# Altium project MiniPC.PrjPcb (part 4 of 10)

## Sheet Ethernet1.SchDoc: 10/100/1000  Ethernet XCVR
size B; DocumentNumber: 6; SheetNumber: 6; SheetTotal: 46
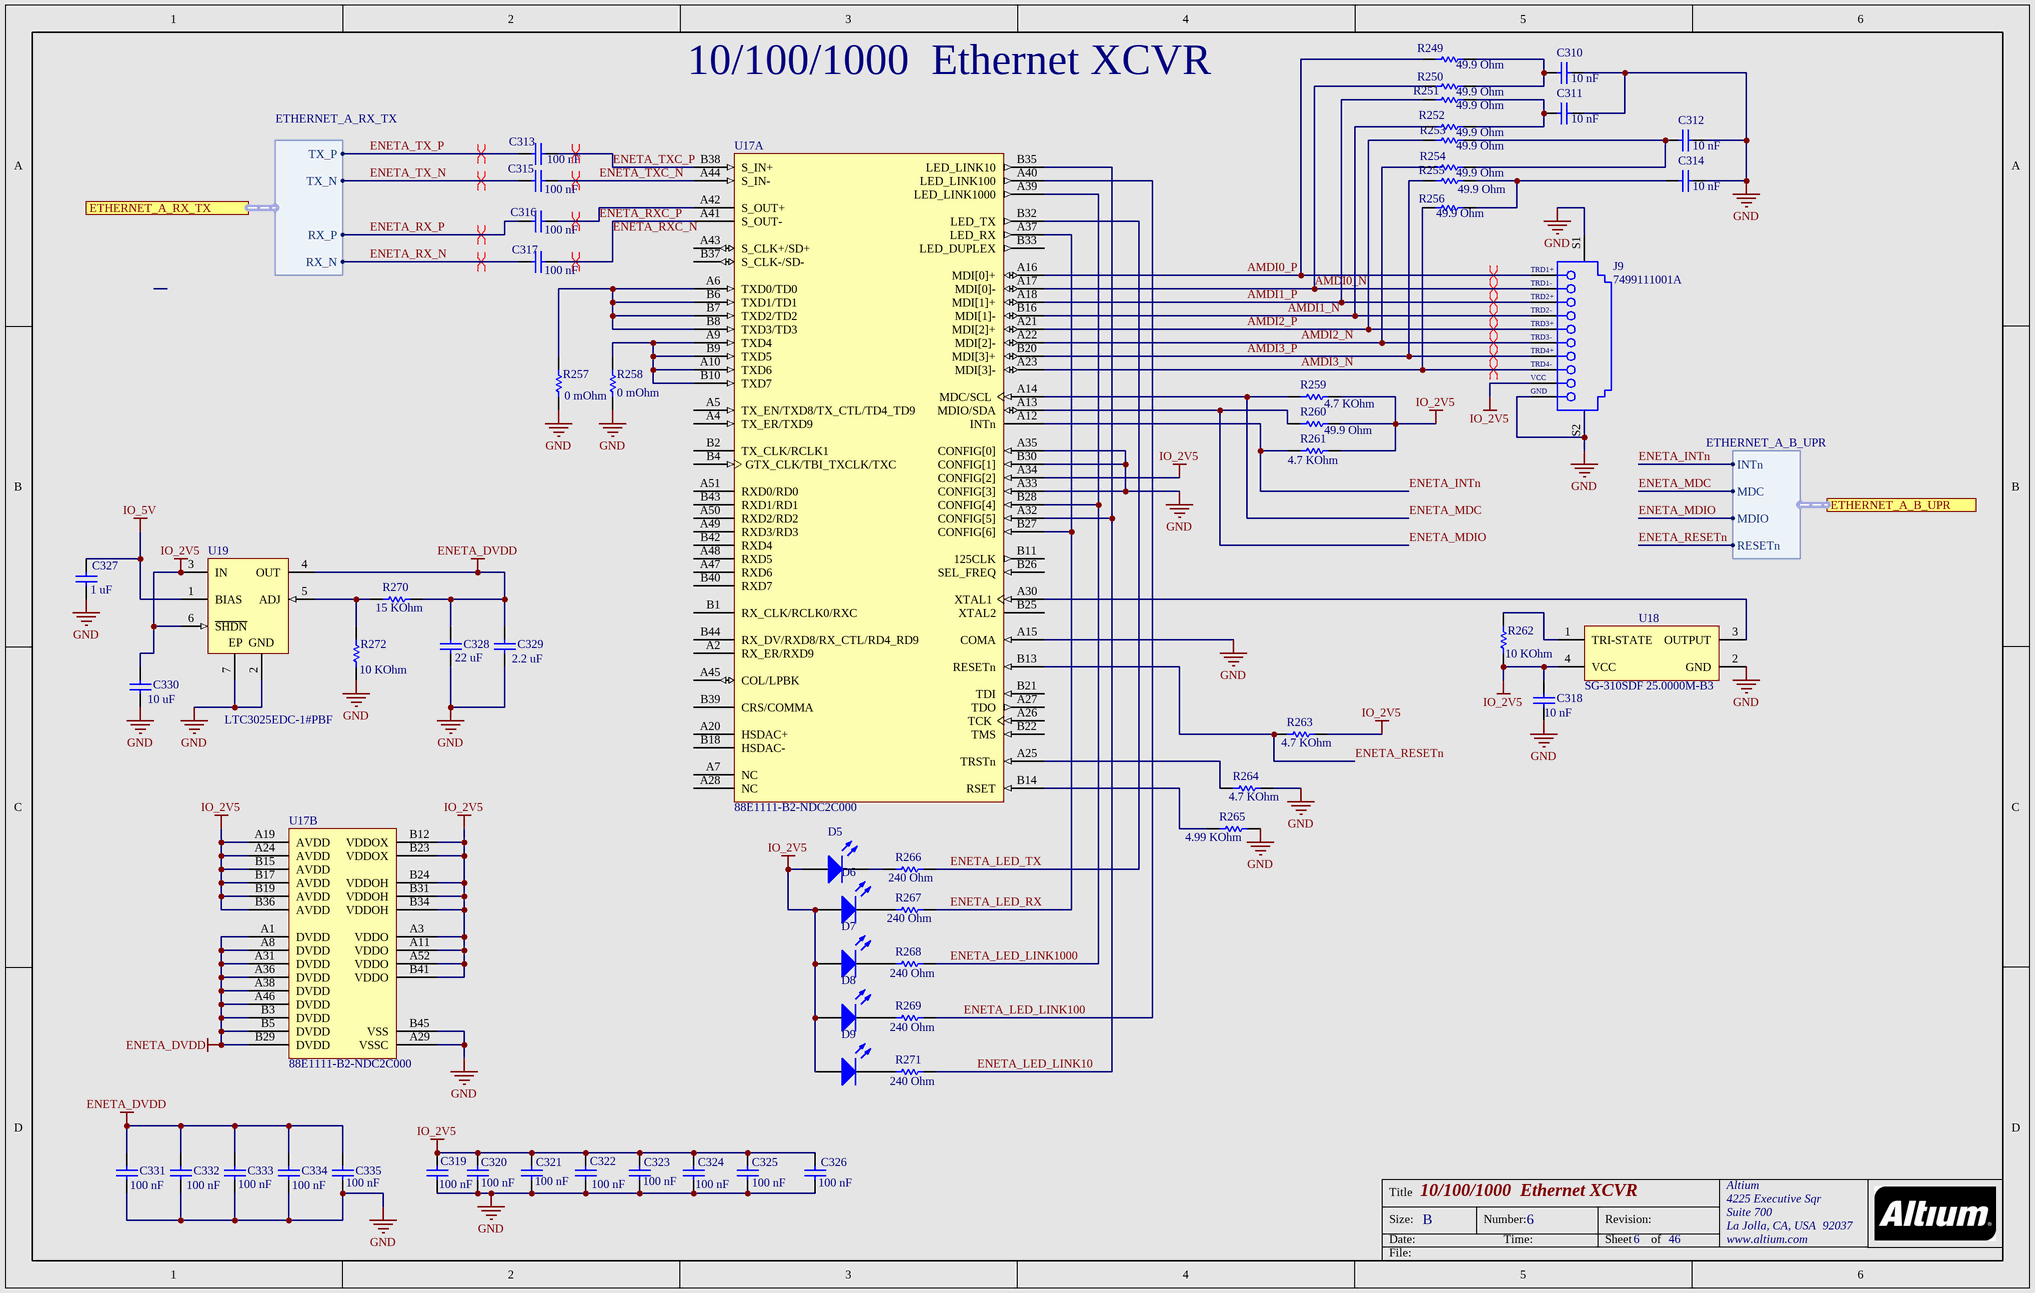
[diagram p14: Ethernet1.SchDoc]

### Parts
C310  Capacitance: 10 nF  [CAPC1005X55X25ML05T10]  (hidden comment: GRM155R71H103KA88D)
C311  Capacitance: 10 nF  [CAPC1005X55X25ML05T10]  (hidden comment: GRM155R71H103KA88D)
C312  Capacitance: 10 nF  [CAPC1005X55X25ML05T10]  (hidden comment: GRM155R71H103KA88D)
C313  Capacitance: 100 nF  [CAPC1005X55X10LL05]  (hidden comment: C1005X7R1E104M)
C314  Capacitance: 10 nF  [CAPC1005X55X25ML05T10]  (hidden comment: GRM155R71H103KA88D)
C315  Capacitance: 100 nF  [CAPC1005X55X10LL05]  (hidden comment: C1005X7R1E104M)
C316  Capacitance: 100 nF  [CAPC1005X55X10LL05]  (hidden comment: C1005X7R1E104M)
C317  Capacitance: 100 nF  [CAPC1005X55X10LL05]  (hidden comment: C1005X7R1E104M)
C318  Capacitance: 10 nF  [CAPC1005X55X25ML05T10]  (hidden comment: GRM155R71H103KA88D)
C319  Capacitance: 100 nF  [CAPC1005X55X10LL05]  (hidden comment: C1005X7R1E104M)
C320  Capacitance: 100 nF  [CAPC1005X55X10LL05]  (hidden comment: C1005X7R1E104M)
C321  Capacitance: 100 nF  [CAPC1005X55X10LL05]  (hidden comment: C1005X7R1E104M)
C322  Capacitance: 100 nF  [CAPC1005X55X10LL05]  (hidden comment: C1005X7R1E104M)
C323  Capacitance: 100 nF  [CAPC1005X55X10LL05]  (hidden comment: C1005X7R1E104M)
C324  Capacitance: 100 nF  [CAPC1005X55X10LL05]  (hidden comment: C1005X7R1E104M)
C325  Capacitance: 100 nF  [CAPC1005X55X10LL05]  (hidden comment: C1005X7R1E104M)
C326  Capacitance: 100 nF  [CAPC1005X55X10LL05]  (hidden comment: C1005X7R1E104M)
C327  Capacitance: 1 uF  [CAPC1005X33X10LL5]  (hidden comment: CGB2A1X5R1E105K033BC)
C328  Capacitance: 22 uF  [CAPC3216X180X55ML20T25]  (hidden comment: GRM31CR61E226KE15L)
C329  Capacitance: 2.2 uF  [CAPC1608X90X35ML10T15]  (hidden comment: GRM188R61A225KE34x)
C330  Capacitance: 10 uF  [CAPC2013X100X20NL20]  (hidden comment: C2012X5R1C106K085AC)
C331  Capacitance: 100 nF  [CAPC1005X55X10LL05]  (hidden comment: C1005X7R1E104M)
C332  Capacitance: 100 nF  [CAPC1005X55X10LL05]  (hidden comment: C1005X7R1E104M)
C333  Capacitance: 100 nF  [CAPC1005X55X10LL05]  (hidden comment: C1005X7R1E104M)
C334  Capacitance: 100 nF  [CAPC1005X55X10LL05]  (hidden comment: C1005X7R1E104M)
C335  Capacitance: 100 nF  [CAPC1005X55X10LL05]  (hidden comment: C1005X7R1E104M)
D5  150060VS75000  [0603_A]  (value not drawn)
D6  150060VS75000  [0603_A]  (value not drawn)
D7  150060VS75000  [0603_A]  (value not drawn)
D8  150060VS75000  [0603_A]  (value not drawn)
D9  150060VS75000  [0603_A]  (value not drawn)
J9  7499111001A  [WE-7499111001A_V]
R249  Resistance: 49.9 Ohm  [RESC1005X35X25NL8T10]  (hidden comment: NRC04F49R9TRF)
R250  Resistance: 49.9 Ohm  [RESC1005X35X25NL8T10]  (hidden comment: NRC04F49R9TRF)
R251  Resistance: 49.9 Ohm  [RESC1005X35X25NL8T10]  (hidden comment: NRC04F49R9TRF)
R252  Resistance: 49.9 Ohm  [RESC1005X35X25NL8T10]  (hidden comment: NRC04F49R9TRF)
R253  Resistance: 49.9 Ohm  [RESC1005X35X25NL8T10]  (hidden comment: NRC04F49R9TRF)
R254  Resistance: 49.9 Ohm  [RESC1005X35X25NL8T10]  (hidden comment: NRC04F49R9TRF)
R255  Resistance: 49.9 Ohm  [RESC1005X35X25NL8T10]  (hidden comment: NRC04F49R9TRF)
R256  Resistance: 49.9 Ohm  [RESC1005X35X25NL8T10]  (hidden comment: NRC04F49R9TRF)
R257  Resistance: 0 mOhm  [RESC1005X40X25ML05T05]  (hidden comment: ERJ-2GE0R00X)
R258  Resistance: 0 mOhm  [RESC1005X40X25ML05T05]  (hidden comment: ERJ-2GE0R00X)
R259  Resistance: 4.7 KOhm  [RESC1005X40X25LL05T05]  (hidden comment: ERJ-2RKF4701X)
R260  Resistance: 49.9 Ohm  [RESC1005X35X25NL8T10]  (hidden comment: NRC04F49R9TRF)
R261  Resistance: 4.7 KOhm  [RESC1005X40X25LL05T05]  (hidden comment: ERJ-2RKF4701X)
R262  Resistance: 10 KOhm  [RESC1005X40X25NL05T05]  (hidden comment: ERJ-2RKF1002X)
R263  Resistance: 4.7 KOhm  [RESC1005X40X25LL05T05]  (hidden comment: ERJ-2RKF4701X)
R264  Resistance: 4.7 KOhm  [RESC1005X40X25LL05T05]  (hidden comment: ERJ-2RKF4701X)
R265  Resistance: 4.99 KOhm  [RESC1005X40X25NL05T05]  (hidden comment: ERJ-2RKF4991X)
R266  Resistance: 240 Ohm  [RESC1005X40X25NL05T05]  (hidden comment: ERJ-2RKF2400X)
R267  Resistance: 240 Ohm  [RESC1005X40X25NL05T05]  (hidden comment: ERJ-2RKF2400X)
R268  Resistance: 240 Ohm  [RESC1005X40X25NL05T05]  (hidden comment: ERJ-2RKF2400X)
R269  Resistance: 240 Ohm  [RESC1005X40X25NL05T05]  (hidden comment: ERJ-2RKF2400X)
R270  Resistance: 15 KOhm  [RESC1005X40X25ML05T05]  (hidden comment: ERJ-2RKF1502X)
R271  Resistance: 240 Ohm  [RESC1005X40X25NL05T05]  (hidden comment: ERJ-2RKF2400X)
R272  Resistance: 10 KOhm  [RESC1005X40X25NL05T05]  (hidden comment: ERJ-2RKF1002X)
U17  88E1111-B2-NDC2C000  [MARV-NDC96]  (parts A,B of 2)
U18  SG-310SDF 25.0000M-B3  [EPSON-SG-310-4_V]
U19  LTC3025EDC-1#PBF  [LT-DC6-6_V]

### Ports
ETHERNET_A_B_UPR (harness ETHERNET_A_B_UPR), ETHERNET_A_RX_TX (harness ETHERNET_A_RX_TX)

### Harnesses
ETHERNET_A_B_UPR: INTn, MDC, MDIO, RESETn
ETHERNET_A_RX_TX: RX_P, RX_N, TX_P, TX_N

### Nets
ENETA_DVDD: C328.2 C329.2 C331.2 C332.2 C333.2 C334.2 C335.2 R270.2 U17.A1(DVDD) U17.A8(DVDD) U17.A31(DVDD) U17.A36(DVDD) U17.A38(DVDD) U17.A46(DVDD) U17.B3(DVDD) U17.B5(DVDD) U17.B29(DVDD) U19.4(OUT)
GND: C310.2 C311.2 C312.2 C314.2 C318.1 C319.1 C320.1 C321.1 C322.1 C323.1 C324.1 C325.1 C326.1 C327.1 C328.1 C329.1 C330.1 C331.1 C332.1 C333.1 C334.1 C335.1 J9.10(GND) J9.S1(SHLD) J9.S2(SHLD) R257.1 R258.1 R264.2 R265.2 R272.1 U17.A15(COMA) U17.A29(VSSC) U17.A33(CONFIG[3]) U17.A35(CONFIG[0]) U17.B30(CONFIG[1]) U17.B45(VSS) U18.2(GND) U19.2(GND) U19.7(EP)
IO_2V5: C318.2 C319.2 C320.2 C321.2 C322.2 C323.2 C324.2 C325.2 C326.2 C330.2 D5.2(A) D6.2(A) D7.2(A) D8.2(A) D9.2(A) J9.9(VCC) R259.2 R260.2 R261.2 R262.1 R263.2 U17.A3(VDDO) U17.A11(VDDO) U17.A19(AVDD) U17.A24(AVDD) U17.A34(CONFIG[2]) U17.A52(VDDO) U17.B12(VDDOX) U17.B15(AVDD) U17.B17(AVDD) U17.B19(AVDD) U17.B23(VDDOX) U17.B24(VDDOH) U17.B31(VDDOH) U17.B34(VDDOH) U17.B36(AVDD) U17.B41(VDDO) U18.4(VCC) U19.3(IN) U19.6(~{SHDN})
IO_5V: C327.2 U19.1(BIAS)
AMDI0_N: J9.2(TRD1-) R250.1 U17.A17(MDI[0]-)
AMDI0_P: J9.1(TRD1+) R249.1 U17.A16(MDI[0]+)
AMDI1_N: J9.4(TRD2-) R252.1 U17.B16(MDI[1]-)
AMDI1_P: J9.3(TRD2+) R251.1 U17.A18(MDI[1]+)
AMDI2_N: J9.6(TRD3-) R254.1 U17.A22(MDI[2]-)
AMDI2_P: J9.5(TRD3+) R253.1 U17.A21(MDI[2]+)
AMDI3_N: J9.8(TRD4-) R256.1 U17.A23(MDI[3]-)
AMDI3_P: J9.7(TRD4+) R255.1 U17.B20(MDI[3]+)
ENETA_INTn: R261.1 U17.A12(INTn) ; port ETHERNET_A_B_UPR.INTn
ENETA_LED_LINK10: R271.2 U17.A32(CONFIG[5]) U17.B35(LED_LINK10)
ENETA_LED_LINK100: R269.2 U17.A40(LED_LINK100)
ENETA_LED_LINK1000: R268.2 U17.A39(LED_LINK1000) U17.B28(CONFIG[4])
ENETA_LED_RX: R267.2 U17.A37(LED_RX) U17.B27(CONFIG[6])
ENETA_LED_TX: R266.2 U17.B32(LED_TX)
ENETA_MDC: R259.1 U17.A14(MDC/SCL) ; port ETHERNET_A_B_UPR.MDC
ENETA_MDIO: R260.1 U17.A13(MDIO/SDA) ; port ETHERNET_A_B_UPR.MDIO
ENETA_RESETn: R263.1 U17.B13(RESETn) ; port ETHERNET_A_B_UPR.RESETn
ENETA_RX_N: C317.1 ; port ETHERNET_A_RX_TX.RX_N
ENETA_RX_P: C316.1 ; port ETHERNET_A_RX_TX.RX_P
ENETA_RXC_N: C317.2 U17.A41(S_OUT-)
ENETA_RXC_P: C316.2 U17.A42(S_OUT+)
ENETA_TX_N: C315.1 ; port ETHERNET_A_RX_TX.TX_N
ENETA_TX_P: C313.1 ; port ETHERNET_A_RX_TX.TX_P
ENETA_TXC_N: C315.2 U17.A44(S_IN-)
ENETA_TXC_P: C313.2 U17.B38(S_IN+)
NetC310_1: C310.1 R249.2 R250.2
NetC311_1: C311.1 R251.2 R252.2
NetC312_1: C312.1 R253.2 R254.2
NetC314_1: C314.1 R255.2 R256.2
NetD5_1: D5.1(K) R266.1
NetD6_1: D6.1(K) R267.1
NetD7_1: D7.1(K) R268.1
NetD8_1: D8.1(K) R269.1
NetD9_1: D9.1(K) R271.1
NetR257_2: R257.2 U17.A6(TXD0/TD0) U17.B6(TXD1/TD1) U17.B7(TXD2/TD2) U17.B8(TXD3/TD3)
NetR258_2: R258.2 U17.A9(TXD4) U17.A10(TXD6) U17.B9(TXD5) U17.B10(TXD7)
NetR262_2: R262.2 U18.1(TRI-STATE)
NetR264_1: R264.1 U17.A25(TRSTn)
NetR265_1: R265.1 U17.B14(RSET)
NetR270_1: R270.1 R272.2 U19.5(ADJ)
NetU17_A30: U17.A30(XTAL1) U18.3(OUTPUT)

Not connected (* = marked no-connect by the designer): U17 A2(RX_ER/RXD9) A4(TX_ER/TXD9) A5(TX_EN/TXD8/TX_CTL/TD4_TD9) A7(NC) A20(HSDAC+) A26(TCK) A27(TDO) A28(NC) A43(S_CLK+/SD+) A45(COL/LPBK) A47(RXD6) A48(RXD5) A49(RXD3/RD3) A50(RXD2/RD2) A51(RXD0/RD0) B1(RX_CLK/RCLK0/RXC) B2(TX_CLK/RCLK1) B4(GTX_CLK/TBI_TXCLK/TXC) B11(125CLK) B18(HSDAC-) B21(TDI) B22(TMS) B25(XTAL2) B26(SEL_FREQ) B33(LED_DUPLEX) B37(S_CLK-/SD-) B39(CRS/COMMA) B40(RXD7) B42(RXD4) B43(RXD1/RD1) B44(RX_DV/RXD8/RX_CTL/RD4_RD9)

### Layout directives
differential pair: AMDI0_N, AMDI0_P, AMDI1_N, AMDI1_P, AMDI2_N, AMDI2_P, AMDI3_N, AMDI3_P, ENETA_RX_N, ENETA_RX_P, ENETA_RXC_N, ENETA_RXC_P, ENETA_TX_N, ENETA_TX_P, ENETA_TXC_N, ENETA_TXC_P

### Notes on the sheet
- Title
- Size:
- Date:
- B
- Number:
- Time:
- Revision:
- Sheet
- of
- File:

### Library data of the parts
C310-C312 C314 C318 = CMP-2008-04637-4: as C362 on sheet Ethernet-HPS; Mounting Technology: Surface Mount; Max Operating Temperature: 125 degC; Height: 0.5 mm; PackageDescription: 2-Pin Surface Mount Device, Body 1 x 0.5 mm; Case Code (Imperial): 0402; Tolerance: 10%; ComponentLink1URL: http://www.murata.com/; RoHSCompliant: true; Width: 0.5 mm; Package Quantity: 10000; Packaging: Tape and Reel; ComponentLink1Description: Manufacturer URL; Min Operating Temperature: -55 degC; PartNumber: GRM155R71H103KA88D; REACH SVHC: No SVHC; Case Code (Metric): 1005; Length: 1 mm; DatasheetVersion: 02/2016; Mount: Surface Mount; Radiation Hardening: No; Lead Pitch: 2mm; Voltage Rating (DC): 50 V; Pins: 2; ComponentLink2URL: http://search.murata.co.jp/Ceramy/image/img/A01X/G101/ENG/GRM155R71H103KA88-01.pdf; ComponentLink2Description: Datasheet; PackageReference: 0402
C313 C315-C317 C319-C326 C331-C335 = CMP-1663-00009-2: as C369 on sheet Ethernet-HPS; Tolerance: 20%; Max Operating Temperature: 125 degC; ComponentLink2URL: http://www.farnell.com/datasheets/1571323.pdf; ComponentLink1URL: http://www.tdk.com/; RoHSCompliant: true; Packaging: Tape and Reel; Mounting Technology: Surface Mount; ComponentLink2Description: Datasheet; Case Code (Imperial): 0402; DatasheetVersion: 09/2011; ComponentLink1Description: Manufacturer URL; PackageDescription: 2-Pin Surface Mount Device, Body 1 x 0.5 mm; PackageReference: 0402; Min Operating Temperature: -55 degC; Case Code (Metric): 1005; Height: 0.5 mm; Package Quantity: 10000; Width: 0.5 mm; Pins: 2; Voltage Rating (DC): 25 V; PartNumber: C1005X7R1E104M; Mount: Surface Mount; Length: 1 mm
C327 = CMP-1663-00006-2: as C384 on sheet Ethernet-HPS; DatasheetVersion: 04/2015; Mounting Technology: Surface Mount; ComponentLink2Description: Datasheet; PackageDescription: 2-Pin Surface Mount Device, Body 1 x 0.5 mm; ComponentLink1URL: http://www.tdk.com/; ComponentLink1Description: Manufacturer URL; ComponentLink2URL: https://product.tdk.com/info/en/catalog/datasheets/mlcc_commercial_lowprofile_en.pdf; PartNumber: CGB2A1X5R1E105K033BC; Case Code (Metric): 1005; RoHSCompliant: True; Max Operating Temperature: 85 degC; Package Quantity: 1; Width: 0.02 inch; Case/Package: 0402; Case Code (Imperial): 0402; Packaging: Tape and Reel; Tolerance: 10%; Length: 0.039 inch; Min Operating Temperature: -55 degC
C328 = CMP-1662-00010-2: as C367 on sheet Ethernet-HPS; Tolerance: 10%; Max Operating Temperature: 85 degC; Package Quantity: 2000; Voltage Rating: 25 V; Case Code (Metric): 3216; Length: 3.2 mm; PackageDescription: 2-Pin Surface Mount Device, Body 3.2 x 1.6 mm; ComponentLink1Description: Manufacturer URL; Case Code (Imperial): 1206; ComponentLink1URL: http://www.murata.com/; Radiation Hardening: No; Height: 1.6 mm; Width: 1.6 mm; DatasheetVersion: 03/2016; Min Operating Temperature: -55 degC; Mount: Surface Mount; REACH SVHC: No SVHC; PackageReference: 1206; ComponentLink2URL: http://search.murata.co.jp/Ceramy/image/img/A01X/G101/ENG/GRM31CR61E226KE15-01.pdf; Packaging: Tape and Reel; RoHSCompliant: true; ComponentLink2Description: Datasheet; Mounting Technology: Surface Mount; PartNumber: GRM31CR61E226KE15L; Pins: 2
C329 = CMP-1662-00016-2: as C368 on sheet Ethernet-HPS; Tolerance: 10%; Width: 0.031 inch; DatasheetVersion: 01/2013; Case/Package: 0603; Length: 0.063 inch; PartNumber: GRM188R61A225KE34x; Package Quantity: 10000; Case Code (Imperial): 0603; Packaging: Tape and Reel; PackageDescription: 2-Pin Surface Mount Device, Body 1.6 x 0.8 mm; Case Code (Metric): 1608; ComponentLink1Description: Manufacturer URL; Radiation Hardening: No; Mounting Technology: Surface Mount; Height: 0.8 mm; RoHSCompliant: True; ComponentLink2URL: https://datasheet.ciiva.com/134/grm188r61a225ke34-01-134206.pdf; ComponentLink2Description: Datasheet; Max Operating Temperature: 85 degC; Min Operating Temperature: -55 degC; ComponentLink1URL: http://www.murata.com/
C330 = CMP-1663-00007-1: as C370 on sheet Ethernet-HPS; Tolerance: 10%; Mounting Technology: Surface Mount; Min Operating Temperature: -55 degC; Length: 2 mm; Case Code (Metric): 2012; PackageReference: 0805; Voltage Rating: 16 V; RoHSCompliant: true; ComponentLink1Description: Manufacturer URL; Width: 1.25 mm; ComponentLink1URL: http://www.tdk.com/; Max Operating Temperature: 85 degC; REACH SVHC: No SVHC; Mount: Surface Mount; ComponentLink2URL: https://product.tdk.com/info/en/catalog/datasheets/mlcc_commercial_general_en.pdf; ComponentLink2Description: Datasheet; Pins: 2; Packaging: Tape and Reel; Height: 0.85 mm; Package Quantity: 1; DatasheetVersion: 03/2015; Case Code (Imperial): 0805; PackageDescription: 2-Pin Surface Mount Device, Body 2 x 1.25 mm
D5-D9 = CMP-1426-00006-1: SMD mono-color Chip LED, WL-SMCW, Bright Green; Manufacturer: Wuerth Elektronik; ComponentLink2URL: http://katalog.we-online.com/led/datasheet/150060VS75000.pdf; ComponentLink1Description: Manufacturer URL; PackageReference: 0603_A; PartNumber: 150060VS75000; ComponentLink2Description: Datasheet; ComponentLink1URL: http://www.we-online.com; Color: Bright Green
J9 = CMP-1710-00001-3: RJ45 LAN Transformer, Modular JACK, 0 to 70 degC, 10-Pin THD, RoHS, Tube; ComponentLink1URL: https://www.we-online.com/; ComponentLink2URL: https://katalog.we-online.de/pbs/datasheet/7499111001A.pdf; ComponentLink2Description: Datasheet; Mounting Technology: Through Hole; PackageDescription: 10-Pin Through Hole Device, Body 21.84 x 16 mm; ComponentLink1Description: Manufacturer URL; PartNumber: 7499111001A; DatasheetVersion: Rev. 01; RoHSCompliant: False
R249-R256 R260 = CMP-1599-00001-2: as R300 on sheet Ethernet-HPS; Tolerance: 1%; ComponentLink2Description: Datasheet; RoHSCompliant: True; DatasheetVersion: 11/2008; Max Operating Temperature: 155 degC; PartNumber: NRC04F49R9TRF; Radiation Hardening: No; PackageDescription: 2-Pin Surface Mount Device, Body 1 x 0.5 mm; Case/Package: 0402; Height: 0.3 mm; Length: 1 mm; ComponentLink1Description: Manufacturer URL; ComponentLink1URL: http://www.niccomp.com/; Mounting Technology: Surface Mount; Packaging: Tape and Reel; ComponentLink2URL: https://datasheet.ciiva.com/27056/2008575-27056094.pdf; Min Operating Temperature: -55 degC
R257 R258 = CMP-2002-00429-3: as R245 on sheet Display_Port; Max Operating Temperature: 155 degC; Tolerance: 5%; PartNumber: ERJ-2GE0R00X; Case Code (Imperial): 0402; Package Quantity: 10000; Length: 1 mm; Mounting Technology: Surface Mount; ComponentLink1URL: http://www.panasonic.com/; Height: 0.35 mm; Width: 0.5 mm; Min Operating Temperature: -55 degC; Case Code (Metric): 1005; RoHSCompliant: true; REACH SVHC: Unknown; ComponentLink1Description: Manufacturer URL; Packaging: Tape and Reel; Mount: Surface Mount; PackageDescription: 2-Pin Surface Mount Device, Body 1 x 0.5 mm; PackageReference: 0402; ComponentLink2URL: http://industrial.panasonic.com/cdbs/www-data/pdf/RDA0000/AOA0000C84.pdf; DatasheetVersion: 03/2015; Radiation Hardening: No; Pins: 2; ComponentLink2Description: Datasheet
R259 R261 R263 R264 = CMP-1665-00031-3: as R302 on sheet Ethernet-HPS; Tolerance: 1%; Case Code (Imperial): 0402; PartNumber: ERJ-2RKF4701X; Mounting Technology: Surface Mount; ComponentLink1Description: Manufacturer URL; Width: 0.5 mm; DatasheetVersion: 04/2015; PackageDescription: 2-Pin Surface Mount Device, Body 1 x 0.5 mm; ComponentLink2Description: Datasheet; Packaging: Cut Tape; RoHSCompliant: true; Package Quantity: 1; Height: 0.35 mm; REACH SVHC: Yes; Case Code (Metric): 1005; Max Operating Temperature: 155 degC; ComponentLink1URL: http://www.panasonic.com/; Radiation Hardening: No; ComponentLink2URL: http://industrial.panasonic.com/cdbs/www-data/pdf/RDA0000/AOA0000C86.pdf; Min Operating Temperature: -55 degC; Length: 1 mm; Pins: 2; PackageReference: 0402; Mount: Surface Mount
R262 R272 = CMP-2002-00607-3: as R311 on sheet Ethernet-HPS; Case Code (Imperial): 0402; Min Operating Temperature: -55 degC; PartNumber: ERJ-2RKF1002X; Mounting Technology: Surface Mount; Length: 1 mm; Packaging: Tape and Reel; ComponentLink1Description: Manufacturer URL; Mount: Surface Mount; Package Quantity: 10000; Max Operating Temperature: 155 degC; Case Code (Metric): 1005; Height: 0.35 mm; ComponentLink1URL: http://www.panasonic.com/; Tolerance: 1%; REACH SVHC: Yes; RoHSCompliant: true; Width: 0.5 mm; PackageDescription: 2-Pin Surface Mount Device, Body 1 x 0.5 mm; Radiation Hardening: No; PackageReference: 0402; ComponentLink2Description: Datasheet; DatasheetVersion: 04/2015; ComponentLink2URL: http://industrial.panasonic.com/cdbs/www-data/pdf/RDA0000/AOA0000C86.pdf; Pins: 2
R265 = CMP-2002-00966-3: Chip Resistor, 4.99 KOhm, +/- 1%, 100 mW, -55 to 155 degC, 0402 (1005 Metric), RoHS, Tape and Reel; Manufacturer: Basic Passives; Voltage Rating: 50 V; Power Rating: 100 mW; Case\/Package: 0402; Length: 1 mm; Package Quantity: 10000; Width: 0.5 mm; PartNumber: ERJ-2RKF4991X; Tolerance: 1%; REACH SVHC: Unknown; Case Code (Imperial): 0402; Height: 0.35 mm; Mount: Surface Mount; RoHSCompliant: true; PackageDescription: 2-Pin Surface Mount Device, Body 1 x 0.5 mm; Max Operating Temperature: 155 degC; ComponentLink1URL: http://www.panasonic.com/; Min Operating Temperature: -55 degC; Packaging: Tape and Reel; ComponentLink1Description: Manufacturer URL; Mounting Technology: Surface Mount; Case Code (Metric): 1005; ComponentLink2URL: http://industrial.panasonic.com/cdbs/www-data/pdf/RDA0000/AOA0000C86.pdf; PackageReference: 0402; Radiation Hardening: No; Pins: 2; DatasheetVersion: 04/2015; ComponentLink2Description: Datasheet; Weight: 2.8E-05oz
R266-R269 R271 = CMP-1665-00034-1: Chip Resistor, 240 Ohm, +/- 1%, 100 mW, -55 to 155 degC, 0402 (1005 Metric), RoHS, Tape and Reel; Power Rating: 100 mW; Voltage Rating: 50 V; Case\/Package: 0402; Tolerance: 1%; Packaging: Tape and Reel; Case Code (Imperial): 0402; Mount: Surface Mount; Min Operating Temperature: -55 degC; RoHSCompliant: true; Mounting Technology: Surface Mount; Max Operating Temperature: 155 degC; REACH SVHC: Unknown; Package Quantity: 10000; ComponentLink1URL: http://www.panasonic.com/; PartNumber: ERJ-2RKF2400X; ComponentLink1Description: Manufacturer URL; Height: 0.35 mm; PackageDescription: 2-Pin Surface Mount Device, Body 1 x 0.5 mm; Width: 0.5 mm; Length: 1 mm; Case Code (Metric): 1005; Radiation Hardening: No; ComponentLink2Description: Datasheet; ComponentLink2URL: http://industrial.panasonic.com/cdbs/www-data/pdf/RDA0000/AOA0000C86.pdf; PackageReference: 0402; DatasheetVersion: 04/2015; Pins: 2
R270 = CMP-2002-00694-3: Chip Resistor, 15 KOhm, +/- 1%, 100 mW, -55 to 155 degC, 0402 (1005 Metric), RoHS, Tape and Reel; Manufacturer: Basic Passives; Power Rating: 100 mW; Voltage Rating: 50 V; Case\/Package: 0402; Max Operating Temperature: 155 degC; Case Code (Imperial): 0402; Case Code (Metric): 1005; PartNumber: ERJ-2RKF1502X; Package Quantity: 10000; REACH SVHC: Yes; Width: 0.5 mm; Mount: Surface Mount; Mounting Technology: Surface Mount; Packaging: Tape and Reel; Tolerance: 1%; ComponentLink1Description: Manufacturer URL; ComponentLink1URL: http://www.panasonic.com/; Height: 0.35 mm; Length: 1 mm; PackageDescription: 2-Pin Surface Mount Device, Body 1 x 0.5 mm; Min Operating Temperature: -55 degC; RoHSCompliant: true; Pins: 2; PackageReference: 0402; DatasheetVersion: 04/2015; ComponentLink2URL: http://industrial.panasonic.com/cdbs/www-data/pdf/RDA0000/AOA0000C86.pdf; Weight: 2.8E-05oz; Radiation Hardening: No; ComponentLink2Description: Datasheet
U17 = CMP-1702-00002-3: Integrated 10/100/1000 Ultra Gigabit Ethernet Transceiver, Commercial Grade, 96-Pin QFN, RoHS; ComponentLink1URL: http://www.marvell.com/; Mounting Technology: Surface Mount; PackageDescription: 96-Pin Quad Flat No-lead Package, Body 9 x 9 mm, Pitch 0.3 mm; ComponentLink2URL: http://www.marvell.com//transceivers/assets/Marvell-Alaska-Ultra-88E1111-GbE.pdf; PartNumber: 88E1111-B2-NDC2C000; ComponentLink2Description: Datasheet; DatasheetVersion: Rev. A; ComponentLink1Description: Manufacturer URL
U18 = CMP-1695-00002-3: as U24 on sheet Ethernet-HPS; ComponentLink2URL: http://www5.epsondevice.com/en/products/spxo_standard/sg310sdf.html#; DatasheetVersion: Rev. Feb-15; ComponentLink1Description: Manufacturer URL; ComponentLink1URL: https://www.eea.epson.com/; Mounting Technology: Surface Mount; PartNumber: SG-310SDF 25.0000M-B3; PackageDescription: 4-Pin Surface Mount Device, Body 3.2 x 2.5 mm; ComponentLink2Description: Datasheet; Max Operating Temperature: 70 degC; Length: 3.2 mm; Packaging: Tape and Reel; Height: 1.05 mm; RoHSCompliant: True; Min Operating Temperature: -20 degC; Width: 2.5 mm
U19 = CMP-0476-00124-4: 500 mA Micropower VLDO Linear Regulator, 0.9 to 5.5 V Vin, Adjustable Vout, 6-pin SON (DC6-6), -40 to 125 degC, Pb-Free; Manufacturer: Linear Technology; Vin Max(V): 5.5; Noise(uV): 80; Vout Min(V): 0.4; Isupply(mA): 0.05; Number of Outputs: 1; Output Voltage: Adj; Dropout Voltage(V): 0.085; Vout Max(V): 3.6; Discrete Pass Element: no; Iout(mA): 500; Vin Min(V): 0.9; ComponentLink1URL: http://www.linear.com/; ComponentLink2URL: http://cds.linear.com/docs/en/datasheet/30251234ff.pdf; ComponentLink1Description: Manufacturer URL; Mounting Technology: Surface Mount; DatasheetVersion: Rev. F; PartNumber: LTC3025EDC-1#PBF; ComponentLink2Description: Datasheet; ComponentLink3URL: http://cds.linear.com/docs/en/packaging/DFN_6_05-08-1703.pdf; PackageDescription: 6-Pin Plastic DFN, Body 2 x 2 mm, Pitch 0.5 mm; Shutdown Current(uA): 1; PackageVersion: Rev. B, 06/2010; ComponentLink3Description: Package Specification; RoHS: TRUE; PackageReference: DC6-6; Code_JEDEC: MO-229

## Sheet Ethernet2.SchDoc: 10/100/1000  Ethernet XCVR
size B; Address1: тро; DocumentNumber: 7; SheetNumber: 7; SheetTotal: 46
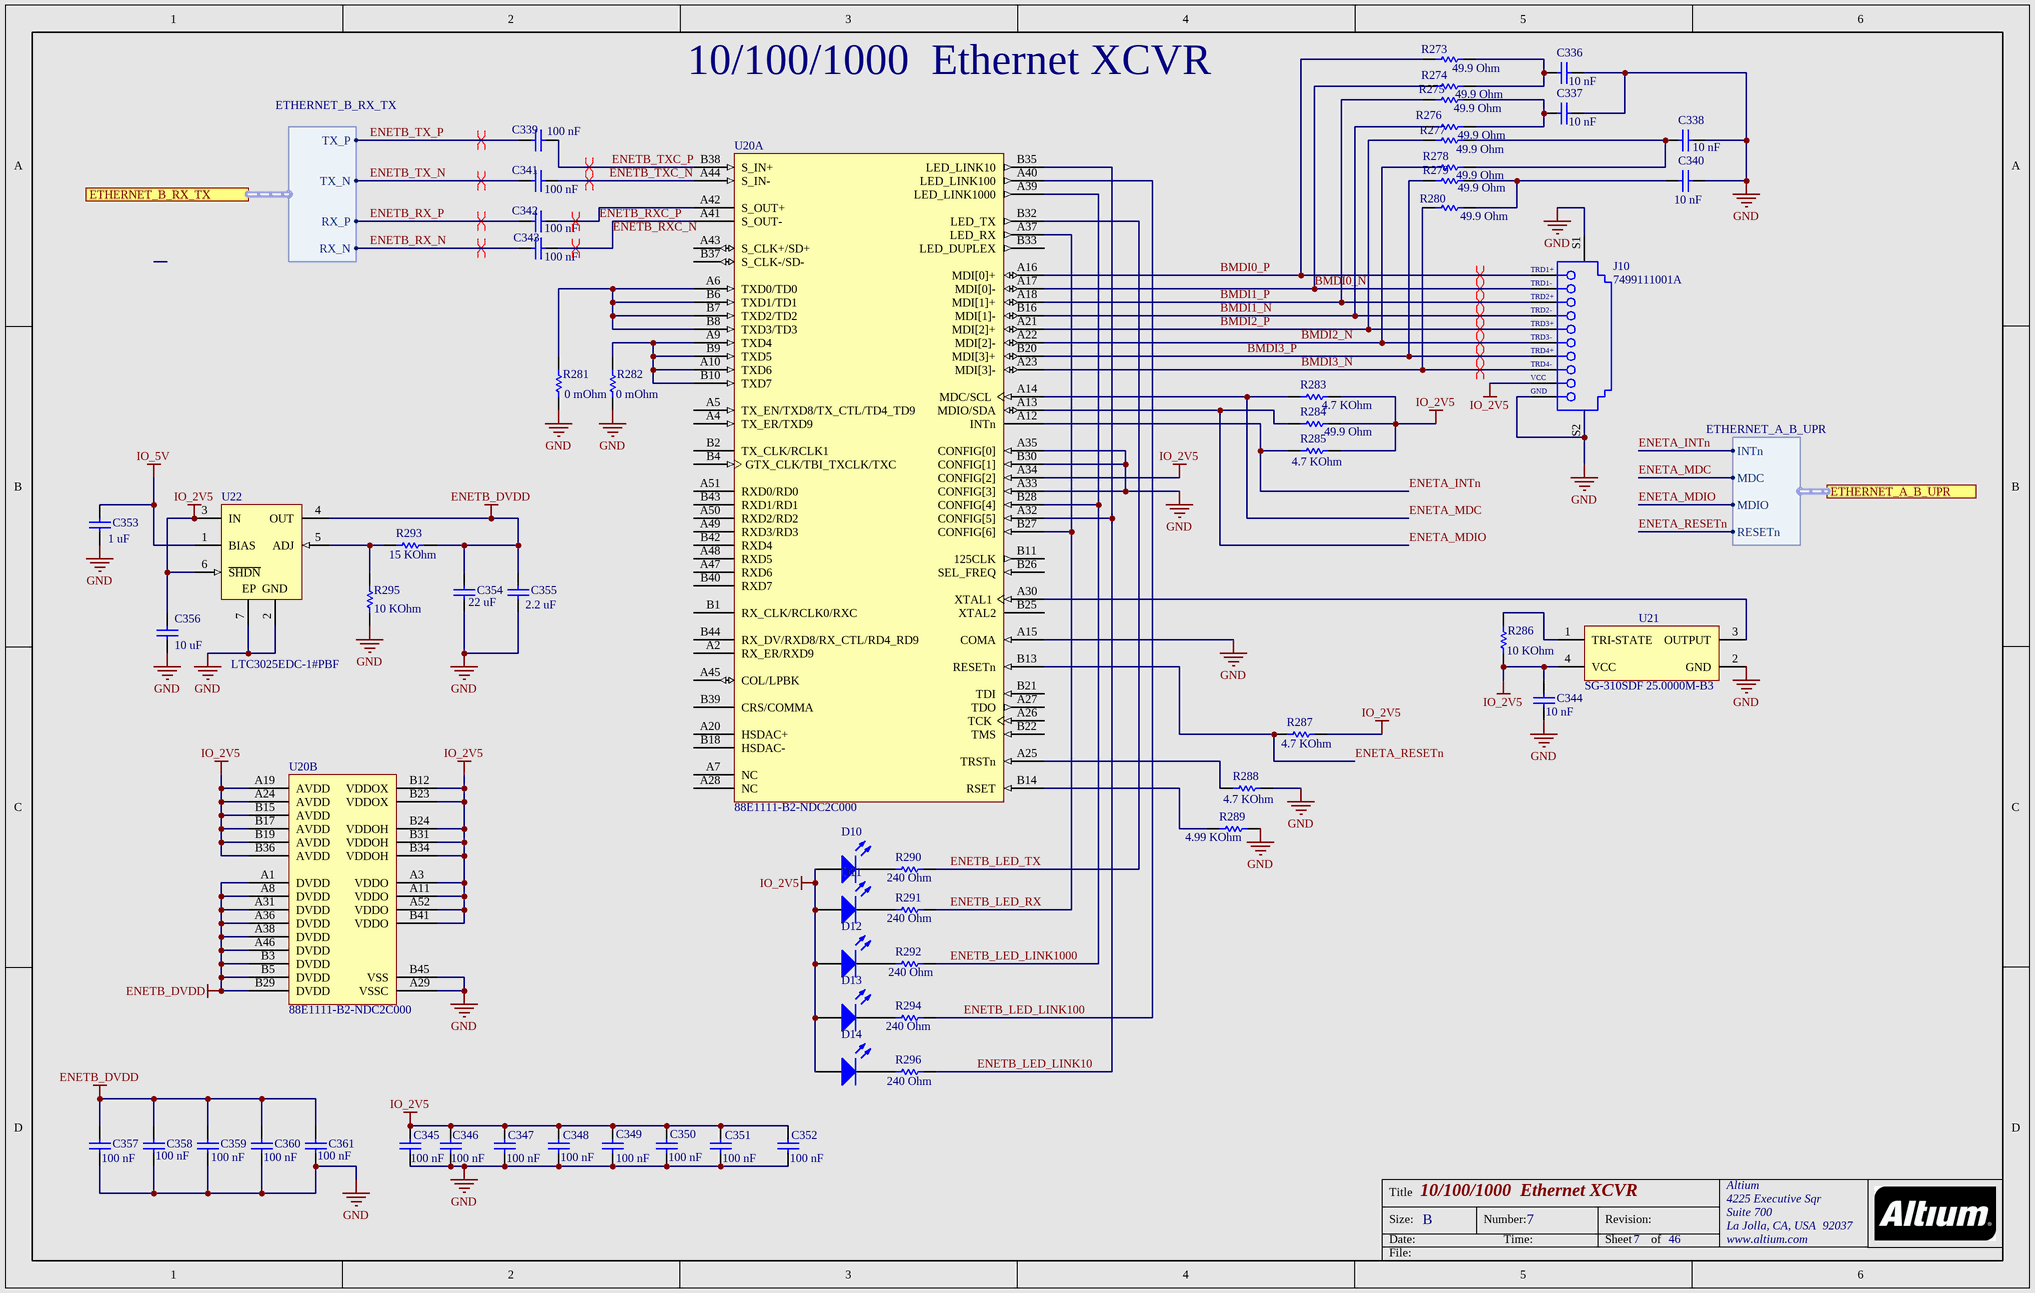
[diagram p15: Ethernet2.SchDoc]

### Parts
C336  Capacitance: 10 nF  [CAPC1005X55X25ML05T10]  (hidden comment: GRM155R71H103KA88D)
C337  Capacitance: 10 nF  [CAPC1005X55X25ML05T10]  (hidden comment: GRM155R71H103KA88D)
C338  Capacitance: 10 nF  [CAPC1005X55X25ML05T10]  (hidden comment: GRM155R71H103KA88D)
C339  Capacitance: 100 nF  [CAPC1005X55X10LL05]  (hidden comment: C1005X7R1E104M)
C340  Capacitance: 10 nF  [CAPC1005X55X25ML05T10]  (hidden comment: GRM155R71H103KA88D)
C341  Capacitance: 100 nF  [CAPC1005X55X10LL05]  (hidden comment: C1005X7R1E104M)
C342  Capacitance: 100 nF  [CAPC1005X55X10LL05]  (hidden comment: C1005X7R1E104M)
C343  Capacitance: 100 nF  [CAPC1005X55X10LL05]  (hidden comment: C1005X7R1E104M)
C344  Capacitance: 10 nF  [CAPC1005X55X25ML05T10]  (hidden comment: GRM155R71H103KA88D)
C345  Capacitance: 100 nF  [CAPC1005X55X10LL05]  (hidden comment: C1005X7R1E104M)
C346  Capacitance: 100 nF  [CAPC1005X55X10LL05]  (hidden comment: C1005X7R1E104M)
C347  Capacitance: 100 nF  [CAPC1005X55X10LL05]  (hidden comment: C1005X7R1E104M)
C348  Capacitance: 100 nF  [CAPC1005X55X10LL05]  (hidden comment: C1005X7R1E104M)
C349  Capacitance: 100 nF  [CAPC1005X55X10LL05]  (hidden comment: C1005X7R1E104M)
C350  Capacitance: 100 nF  [CAPC1005X55X10LL05]  (hidden comment: C1005X7R1E104M)
C351  Capacitance: 100 nF  [CAPC1005X55X10LL05]  (hidden comment: C1005X7R1E104M)
C352  Capacitance: 100 nF  [CAPC1005X55X10LL05]  (hidden comment: C1005X7R1E104M)
C353  Capacitance: 1 uF  [CAPC1005X33X10LL5]  (hidden comment: CGB2A1X5R1E105K033BC)
C354  Capacitance: 22 uF  [CAPC3216X180X55ML20T25]  (hidden comment: GRM31CR61E226KE15L)
C355  Capacitance: 2.2 uF  [CAPC1608X90X35ML10T15]  (hidden comment: GRM188R61A225KE34x)
C356  Capacitance: 10 uF  [CAPC2013X100X20NL20]  (hidden comment: C2012X5R1C106K085AC)
C357  Capacitance: 100 nF  [CAPC1005X55X10LL05]  (hidden comment: C1005X7R1E104M)
C358  Capacitance: 100 nF  [CAPC1005X55X10LL05]  (hidden comment: C1005X7R1E104M)
C359  Capacitance: 100 nF  [CAPC1005X55X10LL05]  (hidden comment: C1005X7R1E104M)
C360  Capacitance: 100 nF  [CAPC1005X55X10LL05]  (hidden comment: C1005X7R1E104M)
C361  Capacitance: 100 nF  [CAPC1005X55X10LL05]  (hidden comment: C1005X7R1E104M)
D10  150060VS75000  [0603_A]  (value not drawn)
D11  150060VS75000  [0603_A]  (value not drawn)
D12  150060VS75000  [0603_A]  (value not drawn)
D13  150060VS75000  [0603_A]  (value not drawn)
D14  150060VS75000  [0603_A]  (value not drawn)
J10  7499111001A  [WE-7499111001A_V]
R273  Resistance: 49.9 Ohm  [RESC1005X35X25NL8T10]  (hidden comment: NRC04F49R9TRF)
R274  Resistance: 49.9 Ohm  [RESC1005X35X25NL8T10]  (hidden comment: NRC04F49R9TRF)
R275  Resistance: 49.9 Ohm  [RESC1005X35X25NL8T10]  (hidden comment: NRC04F49R9TRF)
R276  Resistance: 49.9 Ohm  [RESC1005X35X25NL8T10]  (hidden comment: NRC04F49R9TRF)
R277  Resistance: 49.9 Ohm  [RESC1005X35X25NL8T10]  (hidden comment: NRC04F49R9TRF)
R278  Resistance: 49.9 Ohm  [RESC1005X35X25NL8T10]  (hidden comment: NRC04F49R9TRF)
R279  Resistance: 49.9 Ohm  [RESC1005X35X25NL8T10]  (hidden comment: NRC04F49R9TRF)
R280  Resistance: 49.9 Ohm  [RESC1005X35X25NL8T10]  (hidden comment: NRC04F49R9TRF)
R281  Resistance: 0 mOhm  [RESC1005X40X25ML05T05]  (hidden comment: ERJ-2GE0R00X)
R282  Resistance: 0 mOhm  [RESC1005X40X25ML05T05]  (hidden comment: ERJ-2GE0R00X)
R283  Resistance: 4.7 KOhm  [RESC1005X40X25LL05T05]  (hidden comment: ERJ-2RKF4701X)
R284  Resistance: 49.9 Ohm  [RESC1005X35X25NL8T10]  (hidden comment: NRC04F49R9TRF)
R285  Resistance: 4.7 KOhm  [RESC1005X40X25LL05T05]  (hidden comment: ERJ-2RKF4701X)
R286  Resistance: 10 KOhm  [RESC1005X40X25NL05T05]  (hidden comment: ERJ-2RKF1002X)
R287  Resistance: 4.7 KOhm  [RESC1005X40X25LL05T05]  (hidden comment: ERJ-2RKF4701X)
R288  Resistance: 4.7 KOhm  [RESC1005X40X25LL05T05]  (hidden comment: ERJ-2RKF4701X)
R289  Resistance: 4.99 KOhm  [RESC1005X40X25NL05T05]  (hidden comment: ERJ-2RKF4991X)
R290  Resistance: 240 Ohm  [RESC1005X40X25NL05T05]  (hidden comment: ERJ-2RKF2400X)
R291  Resistance: 240 Ohm  [RESC1005X40X25NL05T05]  (hidden comment: ERJ-2RKF2400X)
R292  Resistance: 240 Ohm  [RESC1005X40X25NL05T05]  (hidden comment: ERJ-2RKF2400X)
R293  Resistance: 15 KOhm  [RESC1005X40X25ML05T05]  (hidden comment: ERJ-2RKF1502X)
R294  Resistance: 240 Ohm  [RESC1005X40X25NL05T05]  (hidden comment: ERJ-2RKF2400X)
R295  Resistance: 10 KOhm  [RESC1005X40X25NL05T05]  (hidden comment: ERJ-2RKF1002X)
R296  Resistance: 240 Ohm  [RESC1005X40X25NL05T05]  (hidden comment: ERJ-2RKF2400X)
U20  88E1111-B2-NDC2C000  [MARV-NDC96]  (parts A,B of 2)
U21  SG-310SDF 25.0000M-B3  [EPSON-SG-310-4_V]
U22  LTC3025EDC-1#PBF  [LT-DC6-6_V]

### Ports
ETHERNET_A_B_UPR (harness ETHERNET_A_B_UPR), ETHERNET_B_RX_TX (harness ETHERNET_B_RX_TX)

### Harnesses
ETHERNET_A_B_UPR: INTn, MDC, MDIO, RESETn
ETHERNET_B_RX_TX: RX_P, RX_N, TX_P, TX_N

### Nets
ENETB_DVDD: C354.2 C355.2 C357.2 C358.2 C359.2 C360.2 C361.2 R293.2 U20.A1(DVDD) U20.A8(DVDD) U20.A31(DVDD) U20.A36(DVDD) U20.A38(DVDD) U20.A46(DVDD) U20.B3(DVDD) U20.B5(DVDD) U20.B29(DVDD) U22.4(OUT)
GND: C336.2 C337.2 C338.2 C340.2 C344.1 C345.1 C346.1 C347.1 C348.1 C349.1 C350.1 C351.1 C352.1 C353.1 C354.1 C355.1 C356.1 C357.1 C358.1 C359.1 C360.1 C361.1 J10.10(GND) J10.S1(SHLD) J10.S2(SHLD) R281.1 R282.1 R288.2 R289.2 R295.1 U20.A15(COMA) U20.A29(VSSC) U20.A33(CONFIG[3]) U20.A35(CONFIG[0]) U20.B30(CONFIG[1]) U20.B45(VSS) U21.2(GND) U22.2(GND) U22.7(EP)
IO_2V5: C344.2 C345.2 C346.2 C347.2 C348.2 C349.2 C350.2 C351.2 C352.2 C356.2 D10.2(A) D11.2(A) D12.2(A) D13.2(A) D14.2(A) J10.9(VCC) R283.2 R284.2 R285.2 R286.1 R287.2 U20.A3(VDDO) U20.A11(VDDO) U20.A19(AVDD) U20.A24(AVDD) U20.A34(CONFIG[2]) U20.A52(VDDO) U20.B12(VDDOX) U20.B15(AVDD) U20.B17(AVDD) U20.B19(AVDD) U20.B23(VDDOX) U20.B24(VDDOH) U20.B31(VDDOH) U20.B34(VDDOH) U20.B36(AVDD) U20.B41(VDDO) U21.4(VCC) U22.3(IN) U22.6(~{SHDN})
IO_5V: C353.2 U22.1(BIAS)
BMDI0_N: J10.2(TRD1-) R274.1 U20.A17(MDI[0]-)
BMDI0_P: J10.1(TRD1+) R273.1 U20.A16(MDI[0]+)
BMDI1_N: J10.4(TRD2-) R276.1 U20.B16(MDI[1]-)
BMDI1_P: J10.3(TRD2+) R275.1 U20.A18(MDI[1]+)
BMDI2_N: J10.6(TRD3-) R278.1 U20.A22(MDI[2]-)
BMDI2_P: J10.5(TRD3+) R277.1 U20.A21(MDI[2]+)
BMDI3_N: J10.8(TRD4-) R280.1 U20.A23(MDI[3]-)
BMDI3_P: J10.7(TRD4+) R279.1 U20.B20(MDI[3]+)
ENETA_INTn: R285.1 U20.A12(INTn) ; port ETHERNET_A_B_UPR.INTn
ENETA_MDC: R283.1 U20.A14(MDC/SCL) ; port ETHERNET_A_B_UPR.MDC
ENETA_MDIO: R284.1 U20.A13(MDIO/SDA) ; port ETHERNET_A_B_UPR.MDIO
ENETA_RESETn: R287.1 U20.B13(RESETn) ; port ETHERNET_A_B_UPR.RESETn
ENETB_LED_LINK10: R296.2 U20.A32(CONFIG[5]) U20.B35(LED_LINK10)
ENETB_LED_LINK100: R294.2 U20.A40(LED_LINK100)
ENETB_LED_LINK1000: R292.2 U20.A39(LED_LINK1000) U20.B28(CONFIG[4])
ENETB_LED_RX: R291.2 U20.A37(LED_RX) U20.B27(CONFIG[6])
ENETB_LED_TX: R290.2 U20.B32(LED_TX)
ENETB_RX_N: C343.1 ; port ETHERNET_B_RX_TX.RX_N
ENETB_RX_P: C342.1 ; port ETHERNET_B_RX_TX.RX_P
ENETB_RXC_N: C343.2 U20.A41(S_OUT-)
ENETB_RXC_P: C342.2 U20.A42(S_OUT+)
ENETB_TX_N: C341.1 ; port ETHERNET_B_RX_TX.TX_N
ENETB_TX_P: C339.1 ; port ETHERNET_B_RX_TX.TX_P
ENETB_TXC_N: C341.2 U20.A44(S_IN-)
ENETB_TXC_P: C339.2 U20.B38(S_IN+)
NetC336_1: C336.1 R273.2 R274.2
NetC337_1: C337.1 R275.2 R276.2
NetC338_1: C338.1 R277.2 R278.2
NetC340_1: C340.1 R279.2 R280.2
NetD10_1: D10.1(K) R290.1
NetD11_1: D11.1(K) R291.1
NetD12_1: D12.1(K) R292.1
NetD13_1: D13.1(K) R294.1
NetD14_1: D14.1(K) R296.1
NetR281_2: R281.2 U20.A6(TXD0/TD0) U20.B6(TXD1/TD1) U20.B7(TXD2/TD2) U20.B8(TXD3/TD3)
NetR282_2: R282.2 U20.A9(TXD4) U20.A10(TXD6) U20.B9(TXD5) U20.B10(TXD7)
NetR286_2: R286.2 U21.1(TRI-STATE)
NetR288_1: R288.1 U20.A25(TRSTn)
NetR289_1: R289.1 U20.B14(RSET)
NetR293_1: R293.1 R295.2 U22.5(ADJ)
NetU20_A30: U20.A30(XTAL1) U21.3(OUTPUT)

Not connected (* = marked no-connect by the designer): U20 A2(RX_ER/RXD9) A4(TX_ER/TXD9) A5(TX_EN/TXD8/TX_CTL/TD4_TD9) A7(NC) A20(HSDAC+) A26(TCK) A27(TDO) A28(NC) A43(S_CLK+/SD+) A45(COL/LPBK) A47(RXD6) A48(RXD5) A49(RXD3/RD3) A50(RXD2/RD2) A51(RXD0/RD0) B1(RX_CLK/RCLK0/RXC) B2(TX_CLK/RCLK1) B4(GTX_CLK/TBI_TXCLK/TXC) B11(125CLK) B18(HSDAC-) B21(TDI) B22(TMS) B25(XTAL2) B26(SEL_FREQ) B33(LED_DUPLEX) B37(S_CLK-/SD-) B39(CRS/COMMA) B40(RXD7) B42(RXD4) B43(RXD1/RD1) B44(RX_DV/RXD8/RX_CTL/RD4_RD9)

### Layout directives
differential pair: BMDI0_N, BMDI0_P, BMDI1_N, BMDI1_P, BMDI2_N, BMDI2_P, BMDI3_N, BMDI3_P, ENETB_RX_N, ENETB_RX_P, ENETB_RXC_N, ENETB_RXC_P, ENETB_TX_N, ENETB_TX_P, ENETB_TXC_N, ENETB_TXC_P

### Notes on the sheet
- Title
- Size:
- Date:
- B
- Number:
- Time:
- Revision:
- Sheet
- of
- File:

### Library data of the parts
C336-C338 C340 C344 = CMP-2008-04637-4: as C362 on sheet Ethernet-HPS; Mounting Technology: Surface Mount; Max Operating Temperature: 125 degC; Height: 0.5 mm; PackageDescription: 2-Pin Surface Mount Device, Body 1 x 0.5 mm; Case Code (Imperial): 0402; Tolerance: 10%; ComponentLink1URL: http://www.murata.com/; RoHSCompliant: true; Width: 0.5 mm; Package Quantity: 10000; Packaging: Tape and Reel; ComponentLink1Description: Manufacturer URL; Min Operating Temperature: -55 degC; PartNumber: GRM155R71H103KA88D; REACH SVHC: No SVHC; Case Code (Metric): 1005; Length: 1 mm; DatasheetVersion: 02/2016; Mount: Surface Mount; Radiation Hardening: No; Lead Pitch: 2mm; Voltage Rating (DC): 50 V; Pins: 2; ComponentLink2URL: http://search.murata.co.jp/Ceramy/image/img/A01X/G101/ENG/GRM155R71H103KA88-01.pdf; ComponentLink2Description: Datasheet; PackageReference: 0402
C339 C341-C343 C345-C352 C357-C361 = CMP-1663-00009-2: as C369 on sheet Ethernet-HPS; Tolerance: 20%; Max Operating Temperature: 125 degC; ComponentLink2URL: http://www.farnell.com/datasheets/1571323.pdf; ComponentLink1URL: http://www.tdk.com/; RoHSCompliant: true; Packaging: Tape and Reel; Mounting Technology: Surface Mount; ComponentLink2Description: Datasheet; Case Code (Imperial): 0402; DatasheetVersion: 09/2011; ComponentLink1Description: Manufacturer URL; PackageDescription: 2-Pin Surface Mount Device, Body 1 x 0.5 mm; PackageReference: 0402; Min Operating Temperature: -55 degC; Case Code (Metric): 1005; Height: 0.5 mm; Package Quantity: 10000; Width: 0.5 mm; Pins: 2; Voltage Rating (DC): 25 V; PartNumber: C1005X7R1E104M; Mount: Surface Mount; Length: 1 mm
C353 = CMP-1663-00006-2: as C384 on sheet Ethernet-HPS; DatasheetVersion: 04/2015; Mounting Technology: Surface Mount; ComponentLink2Description: Datasheet; PackageDescription: 2-Pin Surface Mount Device, Body 1 x 0.5 mm; ComponentLink1URL: http://www.tdk.com/; ComponentLink1Description: Manufacturer URL; ComponentLink2URL: https://product.tdk.com/info/en/catalog/datasheets/mlcc_commercial_lowprofile_en.pdf; PartNumber: CGB2A1X5R1E105K033BC; Case Code (Metric): 1005; RoHSCompliant: True; Max Operating Temperature: 85 degC; Package Quantity: 1; Width: 0.02 inch; Case/Package: 0402; Case Code (Imperial): 0402; Packaging: Tape and Reel; Tolerance: 10%; Length: 0.039 inch; Min Operating Temperature: -55 degC
C354 = CMP-1662-00010-2: as C367 on sheet Ethernet-HPS; Tolerance: 10%; Max Operating Temperature: 85 degC; Package Quantity: 2000; Voltage Rating: 25 V; Case Code (Metric): 3216; Length: 3.2 mm; PackageDescription: 2-Pin Surface Mount Device, Body 3.2 x 1.6 mm; ComponentLink1Description: Manufacturer URL; Case Code (Imperial): 1206; ComponentLink1URL: http://www.murata.com/; Radiation Hardening: No; Height: 1.6 mm; Width: 1.6 mm; DatasheetVersion: 03/2016; Min Operating Temperature: -55 degC; Mount: Surface Mount; REACH SVHC: No SVHC; PackageReference: 1206; ComponentLink2URL: http://search.murata.co.jp/Ceramy/image/img/A01X/G101/ENG/GRM31CR61E226KE15-01.pdf; Packaging: Tape and Reel; RoHSCompliant: true; ComponentLink2Description: Datasheet; Mounting Technology: Surface Mount; PartNumber: GRM31CR61E226KE15L; Pins: 2
C355 = CMP-1662-00016-2: as C368 on sheet Ethernet-HPS; Tolerance: 10%; Width: 0.031 inch; DatasheetVersion: 01/2013; Case/Package: 0603; Length: 0.063 inch; PartNumber: GRM188R61A225KE34x; Package Quantity: 10000; Case Code (Imperial): 0603; Packaging: Tape and Reel; PackageDescription: 2-Pin Surface Mount Device, Body 1.6 x 0.8 mm; Case Code (Metric): 1608; ComponentLink1Description: Manufacturer URL; Radiation Hardening: No; Mounting Technology: Surface Mount; Height: 0.8 mm; RoHSCompliant: True; ComponentLink2URL: https://datasheet.ciiva.com/134/grm188r61a225ke34-01-134206.pdf; ComponentLink2Description: Datasheet; Max Operating Temperature: 85 degC; Min Operating Temperature: -55 degC; ComponentLink1URL: http://www.murata.com/
C356 = CMP-1663-00007-1: as C370 on sheet Ethernet-HPS; Tolerance: 10%; Mounting Technology: Surface Mount; Min Operating Temperature: -55 degC; Length: 2 mm; Case Code (Metric): 2012; PackageReference: 0805; Voltage Rating: 16 V; RoHSCompliant: true; ComponentLink1Description: Manufacturer URL; Width: 1.25 mm; ComponentLink1URL: http://www.tdk.com/; Max Operating Temperature: 85 degC; REACH SVHC: No SVHC; Mount: Surface Mount; ComponentLink2URL: https://product.tdk.com/info/en/catalog/datasheets/mlcc_commercial_general_en.pdf; ComponentLink2Description: Datasheet; Pins: 2; Packaging: Tape and Reel; Height: 0.85 mm; Package Quantity: 1; DatasheetVersion: 03/2015; Case Code (Imperial): 0805; PackageDescription: 2-Pin Surface Mount Device, Body 2 x 1.25 mm
D10-D14 = CMP-1426-00006-1: as D5 on sheet Ethernet1; ComponentLink2URL: http://katalog.we-online.com/led/datasheet/150060VS75000.pdf; ComponentLink1Description: Manufacturer URL; PackageReference: 0603_A; PartNumber: 150060VS75000; ComponentLink2Description: Datasheet; ComponentLink1URL: http://www.we-online.com; Color: Bright Green
J10 = CMP-1710-00001-3: as J9 on sheet Ethernet1; ComponentLink1URL: https://www.we-online.com/; ComponentLink2URL: https://katalog.we-online.de/pbs/datasheet/7499111001A.pdf; ComponentLink2Description: Datasheet; Mounting Technology: Through Hole; PackageDescription: 10-Pin Through Hole Device, Body 21.84 x 16 mm; ComponentLink1Description: Manufacturer URL; PartNumber: 7499111001A; DatasheetVersion: Rev. 01; RoHSCompliant: False
R273-R280 R284 = CMP-1599-00001-2: as R300 on sheet Ethernet-HPS; Tolerance: 1%; ComponentLink2Description: Datasheet; RoHSCompliant: True; DatasheetVersion: 11/2008; Max Operating Temperature: 155 degC; PartNumber: NRC04F49R9TRF; Radiation Hardening: No; PackageDescription: 2-Pin Surface Mount Device, Body 1 x 0.5 mm; Case/Package: 0402; Height: 0.3 mm; Length: 1 mm; ComponentLink1Description: Manufacturer URL; ComponentLink1URL: http://www.niccomp.com/; Mounting Technology: Surface Mount; Packaging: Tape and Reel; ComponentLink2URL: https://datasheet.ciiva.com/27056/2008575-27056094.pdf; Min Operating Temperature: -55 degC
R281 R282 = CMP-2002-00429-3: as R245 on sheet Display_Port; Max Operating Temperature: 155 degC; Tolerance: 5%; PartNumber: ERJ-2GE0R00X; Case Code (Imperial): 0402; Package Quantity: 10000; Length: 1 mm; Mounting Technology: Surface Mount; ComponentLink1URL: http://www.panasonic.com/; Height: 0.35 mm; Width: 0.5 mm; Min Operating Temperature: -55 degC; Case Code (Metric): 1005; RoHSCompliant: true; REACH SVHC: Unknown; ComponentLink1Description: Manufacturer URL; Packaging: Tape and Reel; Mount: Surface Mount; PackageDescription: 2-Pin Surface Mount Device, Body 1 x 0.5 mm; PackageReference: 0402; ComponentLink2URL: http://industrial.panasonic.com/cdbs/www-data/pdf/RDA0000/AOA0000C84.pdf; DatasheetVersion: 03/2015; Radiation Hardening: No; Pins: 2; ComponentLink2Description: Datasheet
R283 R285 R287 R288 = CMP-1665-00031-3: as R302 on sheet Ethernet-HPS; Tolerance: 1%; Case Code (Imperial): 0402; PartNumber: ERJ-2RKF4701X; Mounting Technology: Surface Mount; ComponentLink1Description: Manufacturer URL; Width: 0.5 mm; DatasheetVersion: 04/2015; PackageDescription: 2-Pin Surface Mount Device, Body 1 x 0.5 mm; ComponentLink2Description: Datasheet; Packaging: Cut Tape; RoHSCompliant: true; Package Quantity: 1; Height: 0.35 mm; REACH SVHC: Yes; Case Code (Metric): 1005; Max Operating Temperature: 155 degC; ComponentLink1URL: http://www.panasonic.com/; Radiation Hardening: No; ComponentLink2URL: http://industrial.panasonic.com/cdbs/www-data/pdf/RDA0000/AOA0000C86.pdf; Min Operating Temperature: -55 degC; Length: 1 mm; Pins: 2; PackageReference: 0402; Mount: Surface Mount
R286 R295 = CMP-2002-00607-3: as R311 on sheet Ethernet-HPS; Case Code (Imperial): 0402; Min Operating Temperature: -55 degC; PartNumber: ERJ-2RKF1002X; Mounting Technology: Surface Mount; Length: 1 mm; Packaging: Tape and Reel; ComponentLink1Description: Manufacturer URL; Mount: Surface Mount; Package Quantity: 10000; Max Operating Temperature: 155 degC; Case Code (Metric): 1005; Height: 0.35 mm; ComponentLink1URL: http://www.panasonic.com/; Tolerance: 1%; REACH SVHC: Yes; RoHSCompliant: true; Width: 0.5 mm; PackageDescription: 2-Pin Surface Mount Device, Body 1 x 0.5 mm; Radiation Hardening: No; PackageReference: 0402; ComponentLink2Description: Datasheet; DatasheetVersion: 04/2015; ComponentLink2URL: http://industrial.panasonic.com/cdbs/www-data/pdf/RDA0000/AOA0000C86.pdf; Pins: 2
R289 = CMP-2002-00966-3: as R265 on sheet Ethernet1; Length: 1 mm; Package Quantity: 10000; Width: 0.5 mm; PartNumber: ERJ-2RKF4991X; Tolerance: 1%; REACH SVHC: Unknown; Case Code (Imperial): 0402; Height: 0.35 mm; Mount: Surface Mount; RoHSCompliant: true; PackageDescription: 2-Pin Surface Mount Device, Body 1 x 0.5 mm; Max Operating Temperature: 155 degC; ComponentLink1URL: http://www.panasonic.com/; Min Operating Temperature: -55 degC; Packaging: Tape and Reel; ComponentLink1Description: Manufacturer URL; Mounting Technology: Surface Mount; Case Code (Metric): 1005; ComponentLink2URL: http://industrial.panasonic.com/cdbs/www-data/pdf/RDA0000/AOA0000C86.pdf; PackageReference: 0402; Radiation Hardening: No; Pins: 2; DatasheetVersion: 04/2015; ComponentLink2Description: Datasheet; Weight: 2.8E-05oz
R290-R292 R294 R296 = CMP-1665-00034-1: as R266-R269 on sheet Ethernet1; Tolerance: 1%; Packaging: Tape and Reel; Case Code (Imperial): 0402; Mount: Surface Mount; Min Operating Temperature: -55 degC; RoHSCompliant: true; Mounting Technology: Surface Mount; Max Operating Temperature: 155 degC; REACH SVHC: Unknown; Package Quantity: 10000; ComponentLink1URL: http://www.panasonic.com/; PartNumber: ERJ-2RKF2400X; ComponentLink1Description: Manufacturer URL; Height: 0.35 mm; PackageDescription: 2-Pin Surface Mount Device, Body 1 x 0.5 mm; Width: 0.5 mm; Length: 1 mm; Case Code (Metric): 1005; Radiation Hardening: No; ComponentLink2Description: Datasheet; ComponentLink2URL: http://industrial.panasonic.com/cdbs/www-data/pdf/RDA0000/AOA0000C86.pdf; PackageReference: 0402; DatasheetVersion: 04/2015; Pins: 2
R293 = CMP-2002-00694-3: as R270 on sheet Ethernet1; Max Operating Temperature: 155 degC; Case Code (Imperial): 0402; Case Code (Metric): 1005; PartNumber: ERJ-2RKF1502X; Package Quantity: 10000; REACH SVHC: Yes; Width: 0.5 mm; Mount: Surface Mount; Mounting Technology: Surface Mount; Packaging: Tape and Reel; Tolerance: 1%; ComponentLink1Description: Manufacturer URL; ComponentLink1URL: http://www.panasonic.com/; Height: 0.35 mm; Length: 1 mm; PackageDescription: 2-Pin Surface Mount Device, Body 1 x 0.5 mm; Min Operating Temperature: -55 degC; RoHSCompliant: true; Pins: 2; PackageReference: 0402; DatasheetVersion: 04/2015; ComponentLink2URL: http://industrial.panasonic.com/cdbs/www-data/pdf/RDA0000/AOA0000C86.pdf; Weight: 2.8E-05oz; Radiation Hardening: No; ComponentLink2Description: Datasheet
U20 = CMP-1702-00002-3: as U17 on sheet Ethernet1; ComponentLink1URL: http://www.marvell.com/; Mounting Technology: Surface Mount; PackageDescription: 96-Pin Quad Flat No-lead Package, Body 9 x 9 mm, Pitch 0.3 mm; ComponentLink2URL: http://www.marvell.com//transceivers/assets/Marvell-Alaska-Ultra-88E1111-GbE.pdf; PartNumber: 88E1111-B2-NDC2C000; ComponentLink2Description: Datasheet; DatasheetVersion: Rev. A; ComponentLink1Description: Manufacturer URL
U21 = CMP-1695-00002-3: as U24 on sheet Ethernet-HPS; ComponentLink2URL: http://www5.epsondevice.com/en/products/spxo_standard/sg310sdf.html#; DatasheetVersion: Rev. Feb-15; ComponentLink1Description: Manufacturer URL; ComponentLink1URL: https://www.eea.epson.com/; Mounting Technology: Surface Mount; PartNumber: SG-310SDF 25.0000M-B3; PackageDescription: 4-Pin Surface Mount Device, Body 3.2 x 2.5 mm; ComponentLink2Description: Datasheet; Max Operating Temperature: 70 degC; Length: 3.2 mm; Packaging: Tape and Reel; Height: 1.05 mm; RoHSCompliant: True; Min Operating Temperature: -20 degC; Width: 2.5 mm
U22 = CMP-0476-00124-4: as U19 on sheet Ethernet1; ComponentLink1URL: http://www.linear.com/; ComponentLink2URL: http://cds.linear.com/docs/en/datasheet/30251234ff.pdf; ComponentLink1Description: Manufacturer URL; Mounting Technology: Surface Mount; DatasheetVersion: Rev. F; PartNumber: LTC3025EDC-1#PBF; ComponentLink2Description: Datasheet; ComponentLink3URL: http://cds.linear.com/docs/en/packaging/DFN_6_05-08-1703.pdf; PackageDescription: 6-Pin Plastic DFN, Body 2 x 2 mm, Pitch 0.5 mm; Shutdown Current(uA): 1; PackageVersion: Rev. B, 06/2010; ComponentLink3Description: Package Specification; RoHS: TRUE; PackageReference: DC6-6; Code_JEDEC: MO-229

## Sheet miniPCIE_Connector.SchDoc: miniPCIE Connector
size B; DocumentNumber: 10; SheetNumber: 10; SheetTotal: 46
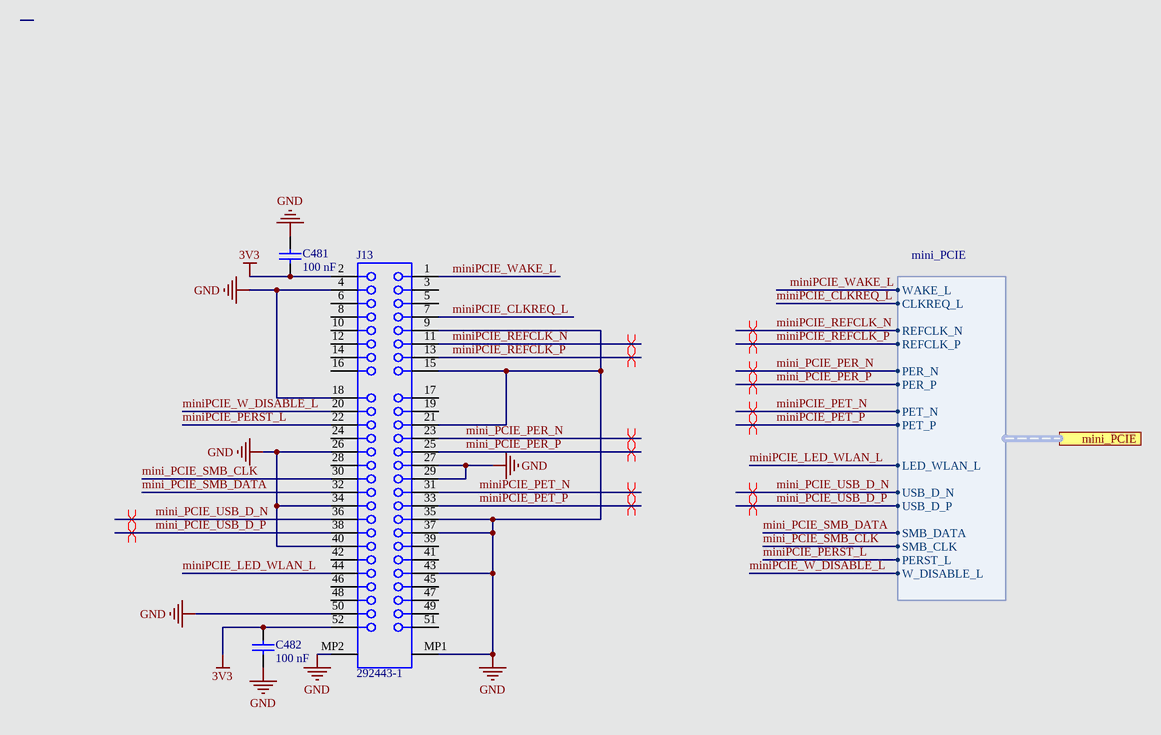
[diagram p16: miniPCIE_Connector.SchDoc]

### Parts
C481  Capacitance: 100 nF  [CAPC1005X55X10LL05]  (hidden comment: C1005X7R1E104M)
C482  Capacitance: 100 nF  [CAPC1005X55X10LL05]  (hidden comment: C1005X7R1E104M)
J13  292443-1  [BTB-SM0-8-2H52F]

### Ports
mini_PCIE (harness mini_PCIE)

### Harnesses
mini_PCIE: WAKE_L, CLKREQ_L, REFCLK_N, REFCLK_P, PER_N, PER_P, PET_N, PET_P, LED_WLAN_L, USB_D_N, USB_D_P, SMB_DATA, SMB_CLK, PERST_L, W_DISABLE_L

### Nets
3V3: C481.2 C482.1 J13.2 J13.52
GND: C481.1 C482.2 J13.4 J13.9 J13.15 J13.18 J13.21 J13.26 J13.27 J13.29 J13.34 J13.35 J13.37 J13.40 J13.43 J13.50 J13.MP1 J13.MP2
mini_PCIE_PER_N: J13.23 ; port mini_PCIE.PER_N
mini_PCIE_PER_P: J13.25 ; port mini_PCIE.PER_P
mini_PCIE_SMB_CLK: J13.30 ; port mini_PCIE.SMB_CLK
mini_PCIE_SMB_DATA: J13.32 ; port mini_PCIE.SMB_DATA
mini_PCIE_USB_D_N: J13.36 ; port mini_PCIE.USB_D_N
mini_PCIE_USB_D_P: J13.38 ; port mini_PCIE.USB_D_P
miniPCIE_CLKREQ_L: J13.7 ; port mini_PCIE.CLKREQ_L
miniPCIE_LED_WLAN_L: J13.44 ; port mini_PCIE.LED_WLAN_L
miniPCIE_PERST_L: J13.22 ; port mini_PCIE.PERST_L
miniPCIE_PET_N: J13.31 ; port mini_PCIE.PET_N
miniPCIE_PET_P: J13.33 ; port mini_PCIE.PET_P
miniPCIE_REFCLK_N: J13.11 ; port mini_PCIE.REFCLK_N
miniPCIE_REFCLK_P: J13.13 ; port mini_PCIE.REFCLK_P
miniPCIE_W_DISABLE_L: J13.20 ; port mini_PCIE.W_DISABLE_L
miniPCIE_WAKE_L: J13.1 ; port mini_PCIE.WAKE_L

Not connected (* = marked no-connect by the designer): J13 3 5 6 8 10 12 14 16 17 19 24 28 39 41 42 45 46 47 48 49 51

### Layout directives
differential pair: mini_PCIE_PER_N, mini_PCIE_PER_P, mini_PCIE_USB_D_N, mini_PCIE_USB_D_P, miniPCIE_PET_N, miniPCIE_PET_P, miniPCIE_REFCLK_N, miniPCIE_REFCLK_P

### Notes on the sheet
- Title
- Size:
- Date:
- B
- Number:
- Time:
- Revision:
- Sheet
- of
- File:

### Library data of the parts
C481 C482 = CMP-1663-00009-2: as C369 on sheet Ethernet-HPS; Tolerance: 20%; Mounting Technology: Surface Mount; Max Operating Temperature: 125 degC; ComponentLink2URL: http://www.farnell.com/datasheets/1571323.pdf; ComponentLink1URL: http://www.tdk.com/; RoHSCompliant: true; Packaging: Tape and Reel; ComponentLink2Description: Datasheet; Case Code (Imperial): 0402; DatasheetVersion: 09/2011; ComponentLink1Description: Manufacturer URL; PackageDescription: 2-Pin Surface Mount Device, Body 1 x 0.5 mm; PackageReference: 0402; Min Operating Temperature: -55 degC; Case Code (Metric): 1005; Height: 0.5 mm; Package Quantity: 10000; Width: 0.5 mm; Pins: 2; Voltage Rating (DC): 25 V; PartNumber: C1005X7R1E104M; Mount: Surface Mount; Length: 1 mm
J13 = CMP-0001-00120-2: Board-to-Board Connector, SMT, Right Angle, Pitch 0.8mm, 52-Position, Female; Mating Connector: PCIeMini-CN-2S-M-R52; Publisher: Altium; Package Reference: BTB-SM0-8-2H52F; Datasheet Version: Oct-2006; ClassName: Board Template Connector; Component Kind: Standard; System: Connector